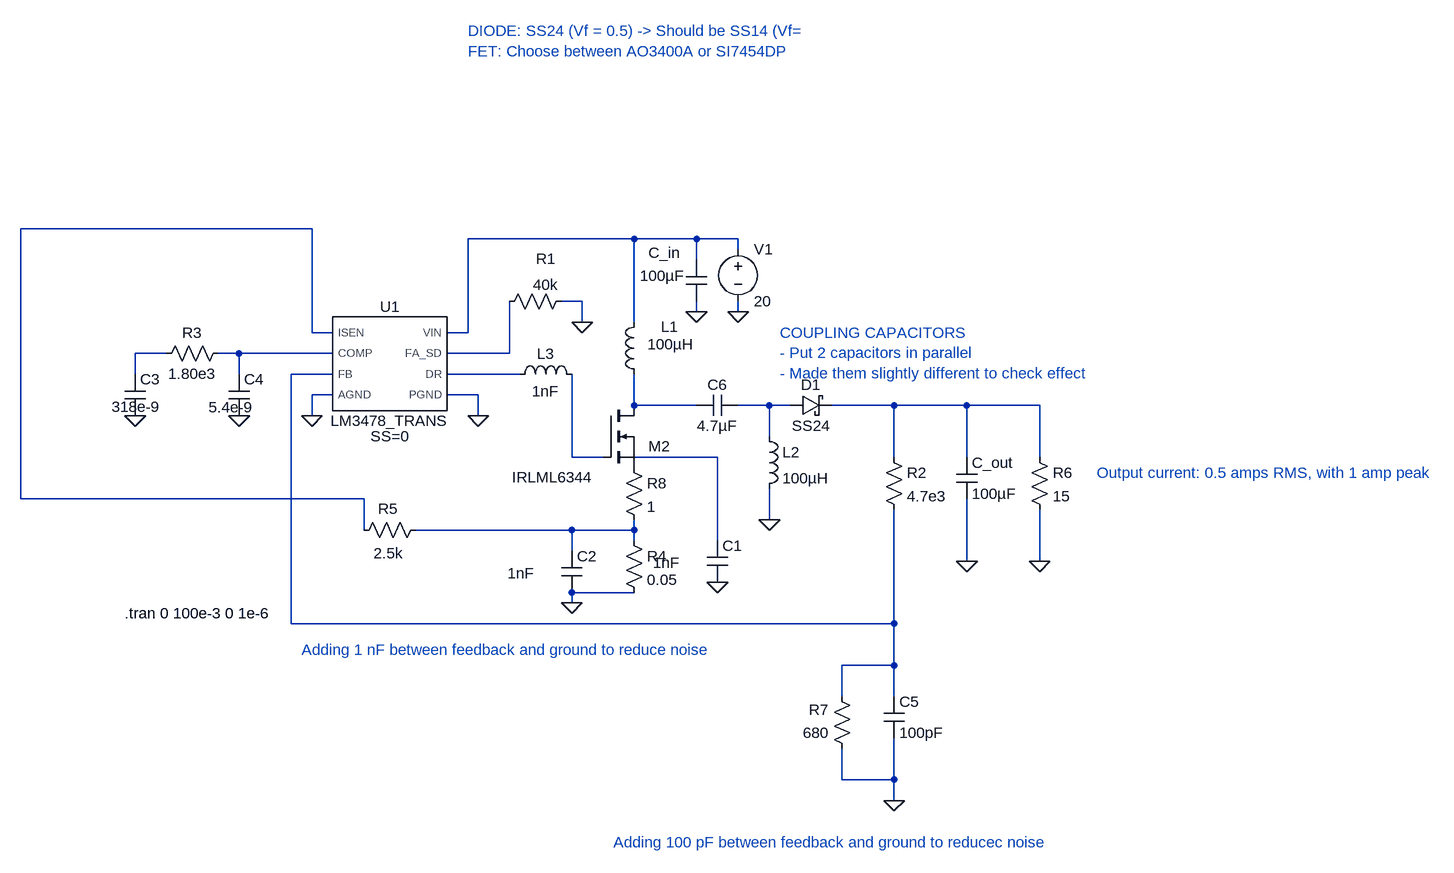
[diagram p0: schematic sepic_10V.asc]
sepic_10V.asc, the LTspice schematic file:
Version 4
SHEET 1 1524 1396
WIRE -240 -80 -688 -80
WIRE 256 -64 0 -64
WIRE 352 -64 256 -64
WIRE 416 -64 352 -64
WIRE 416 -48 416 -64
WIRE 352 -32 352 -64
WIRE 176 32 144 32
WIRE 352 48 352 32
WIRE 416 48 416 32
WIRE 176 64 176 32
WIRE 256 64 256 -64
WIRE -240 80 -240 -80
WIRE -208 80 -240 80
WIRE 0 80 0 -64
WIRE 0 80 -32 80
WIRE -464 112 -512 112
WIRE -352 112 -384 112
WIRE -208 112 -352 112
WIRE 64 112 64 32
WIRE 64 112 -32 112
WIRE -512 144 -512 112
WIRE -352 144 -352 112
WIRE -208 144 -272 144
WIRE 80 144 -32 144
WIRE -208 176 -240 176
WIRE 16 176 -32 176
WIRE 256 192 256 144
WIRE 352 192 256 192
WIRE 464 192 416 192
WIRE 496 192 464 192
WIRE 656 192 560 192
WIRE 768 192 656 192
WIRE 880 192 768 192
WIRE -240 208 -240 176
WIRE 16 208 16 176
WIRE 464 240 464 192
WIRE 160 272 160 144
WIRE 208 272 160 272
WIRE 384 272 256 272
WIRE 656 272 656 192
WIRE 768 272 768 192
WIRE 880 272 880 192
WIRE -688 336 -688 -80
WIRE -160 336 -688 336
WIRE 464 368 464 320
WIRE -160 384 -160 336
WIRE 160 384 -80 384
WIRE 256 384 256 368
WIRE 256 384 160 384
WIRE 256 400 256 384
WIRE 384 400 384 272
WIRE 160 416 160 384
WIRE 768 432 768 336
WIRE 880 432 880 352
WIRE 256 480 160 480
WIRE 160 496 160 480
WIRE -272 528 -272 144
WIRE 656 528 656 352
WIRE 656 528 -272 528
WIRE 656 592 656 528
WIRE 656 592 576 592
WIRE 576 640 576 592
WIRE 656 640 656 592
WIRE 576 768 576 720
WIRE 656 768 656 704
WIRE 656 768 576 768
WIRE 656 800 656 768
FLAG 176 64 0
FLAG -240 208 0
FLAG 16 208 0
FLAG 160 496 0
FLAG 880 432 0
FLAG 416 48 0
FLAG 352 48 0
FLAG 768 432 0
FLAG 464 368 0
FLAG 656 800 0
FLAG -512 208 0
FLAG -352 208 0
FLAG 384 464 0
SYMBOL ind 272 160 R180
WINDOW 0 -52 89 Left 2
WINDOW 3 -76 62 Left 2
SYMATTR InstName L1
SYMATTR Value 100µH
SYMATTR SpiceLine Rser=0.3
SYMBOL res 48 48 R270
WINDOW 0 66 72 VTop 2
WINDOW 3 57 72 VBottom 2
SYMATTR InstName R1
SYMATTR Value 40k
SYMBOL schottky 496 208 R270
WINDOW 0 32 32 VTop 2
WINDOW 3 0 32 VBottom 2
SYMATTR InstName D1
SYMATTR Value SS24
SYMATTR Description Diode
SYMATTR Type diode
SYMBOL cap 752 272 R0
SYMATTR InstName C_out
SYMATTR Value 100µF
SYMBOL res 640 256 R0
SYMATTR InstName R2
SYMATTR Value 4.7e3
SYMBOL cap 144 416 R0
WINDOW 3 -83 34 Left 2
SYMATTR Value 1nF
SYMATTR InstName C2
SYMBOL res 240 384 R0
SYMATTR InstName R4
SYMATTR Value 0.05
SYMBOL res 864 256 R0
SYMATTR InstName R6
SYMATTR Value 15
SYMBOL voltage 416 -64 R0
WINDOW 123 0 0 Left 0
WINDOW 39 0 0 Left 0
SYMATTR InstName V1
SYMATTR Value 20
SYMBOL cap 336 -32 R0
WINDOW 0 -58 -11 Left 2
WINDOW 3 -71 25 Left 2
SYMATTR InstName C_in
SYMATTR Value 100µF
SYMBOL ind 448 224 R0
SYMATTR InstName L2
SYMATTR Value 100µH
SYMATTR SpiceLine Rser=0.3
SYMBOL cap 640 640 R0
SYMATTR InstName C5
SYMATTR Value 100pF
SYMBOL res 592 736 R180
WINDOW 0 36 76 Left 2
WINDOW 3 36 40 Left 2
SYMATTR InstName R7
SYMATTR Value 680
SYMBOL cap -528 144 R0
WINDOW 3 -20 50 Left 2
SYMATTR Value 318e-9
SYMATTR InstName C3
SYMBOL cap -368 144 R0
WINDOW 3 -31 51 Left 2
SYMATTR Value 5.4e-9
SYMATTR InstName C4
SYMBOL res -368 96 R90
WINDOW 0 0 56 VBottom 2
WINDOW 3 32 56 VTop 2
SYMATTR InstName R3
SYMATTR Value 1.80e3
SYMBOL res -176 400 R270
WINDOW 0 33 53 VTop 2
WINDOW 3 -4 54 VBottom 2
SYMATTR InstName R5
SYMATTR Value 2.5k
SYMBOL ind 64 160 R270
WINDOW 0 32 56 VTop 2
WINDOW 3 5 56 VBottom 2
SYMATTR InstName L3
SYMATTR Value 1nF
SYMATTR SpiceLine Rser=10
SYMBOL nmos 208 192 R0
WINDOW 0 70 63 Left 2
WINDOW 3 -140 111 Left 2
SYMATTR InstName M2
SYMATTR Value IRLML6344
SYMBOL cap 416 176 R90
WINDOW 0 0 32 VBottom 2
WINDOW 3 32 32 VTop 2
SYMATTR InstName C6
SYMATTR Value 4.7µF
SYMATTR SpiceLine Rser=2.3e-3 Lser=3e-9
SYMBOL LM3478_TRANS -128 128 R0
SYMATTR InstName U1
SYMBOL res 240 272 R0
SYMATTR InstName R8
SYMATTR Value 1
SYMBOL cap 368 400 R0
WINDOW 3 -83 34 Left 2
SYMATTR Value 1nF
SYMATTR InstName C1
TEXT -528 512 Left 2 !.tran 0 100e-3 0 1e-6
TEXT 0 -384 Left 2 ;DIODE: SS24 (Vf = 0.5) -> Should be SS14 (Vf=\nFET: Choose between AO3400A or SI7454DP
TEXT 224 864 Left 2 ;Adding 100 pF between feedback and ground to reducec noise
TEXT -256 568 Left 2 ;Adding 1 nF between feedback and ground to reduce noise
TEXT 968 296 Left 2 ;Output current: 0.5 amps RMS, with 1 amp peak
TEXT 480 80 Left 2 ;COUPLING CAPACITORS\n- Put 2 capacitors in parallel\n- Made them slightly different to check effect

The netlist it stands for:
* sepic_10V.asc
L1 N008 N002 100µH Rser=0.3
R1 N005 0 40k
D1 N009 N010 SS24
C_out N010 0 100µF
R2 N010 N006 4.7e3
C2 N013 0 1nF
R4 N013 0 0.05
R6 N010 0 15
V1 N002 0 20
C_in N002 0 100µF
L2 N009 0 100µH Rser=0.3
C5 N006 0 100pF
R7 0 N006 680
C3 N003 0 318e-9
C4 N004 0 5.4e-9
R3 N004 N003 1.80e3
R5 N001 N013 2.5k
L3 N007 N011 1nF Rser=10
M2 N008 N011 P001 P001 IRLML6344
C6 N009 N008 4.7µF Rser=2.3e-3 Lser=3e-9
XU1 0 N004 N007 N005 N006 N001 0 N002 LM3478_TRANS SS=0  ; pins AGND COMP DR FA_SD FB ISEN PGND VIN
R8 P001 N013 1
C1 N012 0 1nF
.model D D
.lib standard.dio
.model NMOS NMOS
.model PMOS PMOS
.lib standard.mos
.tran 0 100e-3 0 1e-6
* DIODE: SS24 (Vf = 0.5) -> Should be SS14 (Vf=
* FET: Choose between AO3400A or SI7454DP
* Adding 100 pF between feedback and ground to reducec noise
* Adding 1 nF between feedback and ground to reduce noise
* Output current: 0.5 amps RMS, with 1 amp peak
* COUPLING CAPACITORS
* - Put 2 capacitors in parallel
* - Made them slightly different to check effect
.lib C:\users\iwolfs\Favorites\acoustic-material-characterization\acoustic-piezodriver-hw\simulations\libs\LM3478_TRANS.lib
.backanno
.end